# EAGLE design ProbeCDH_r1.0 (EAGLE 5.00)

## Sheet 1 of 2
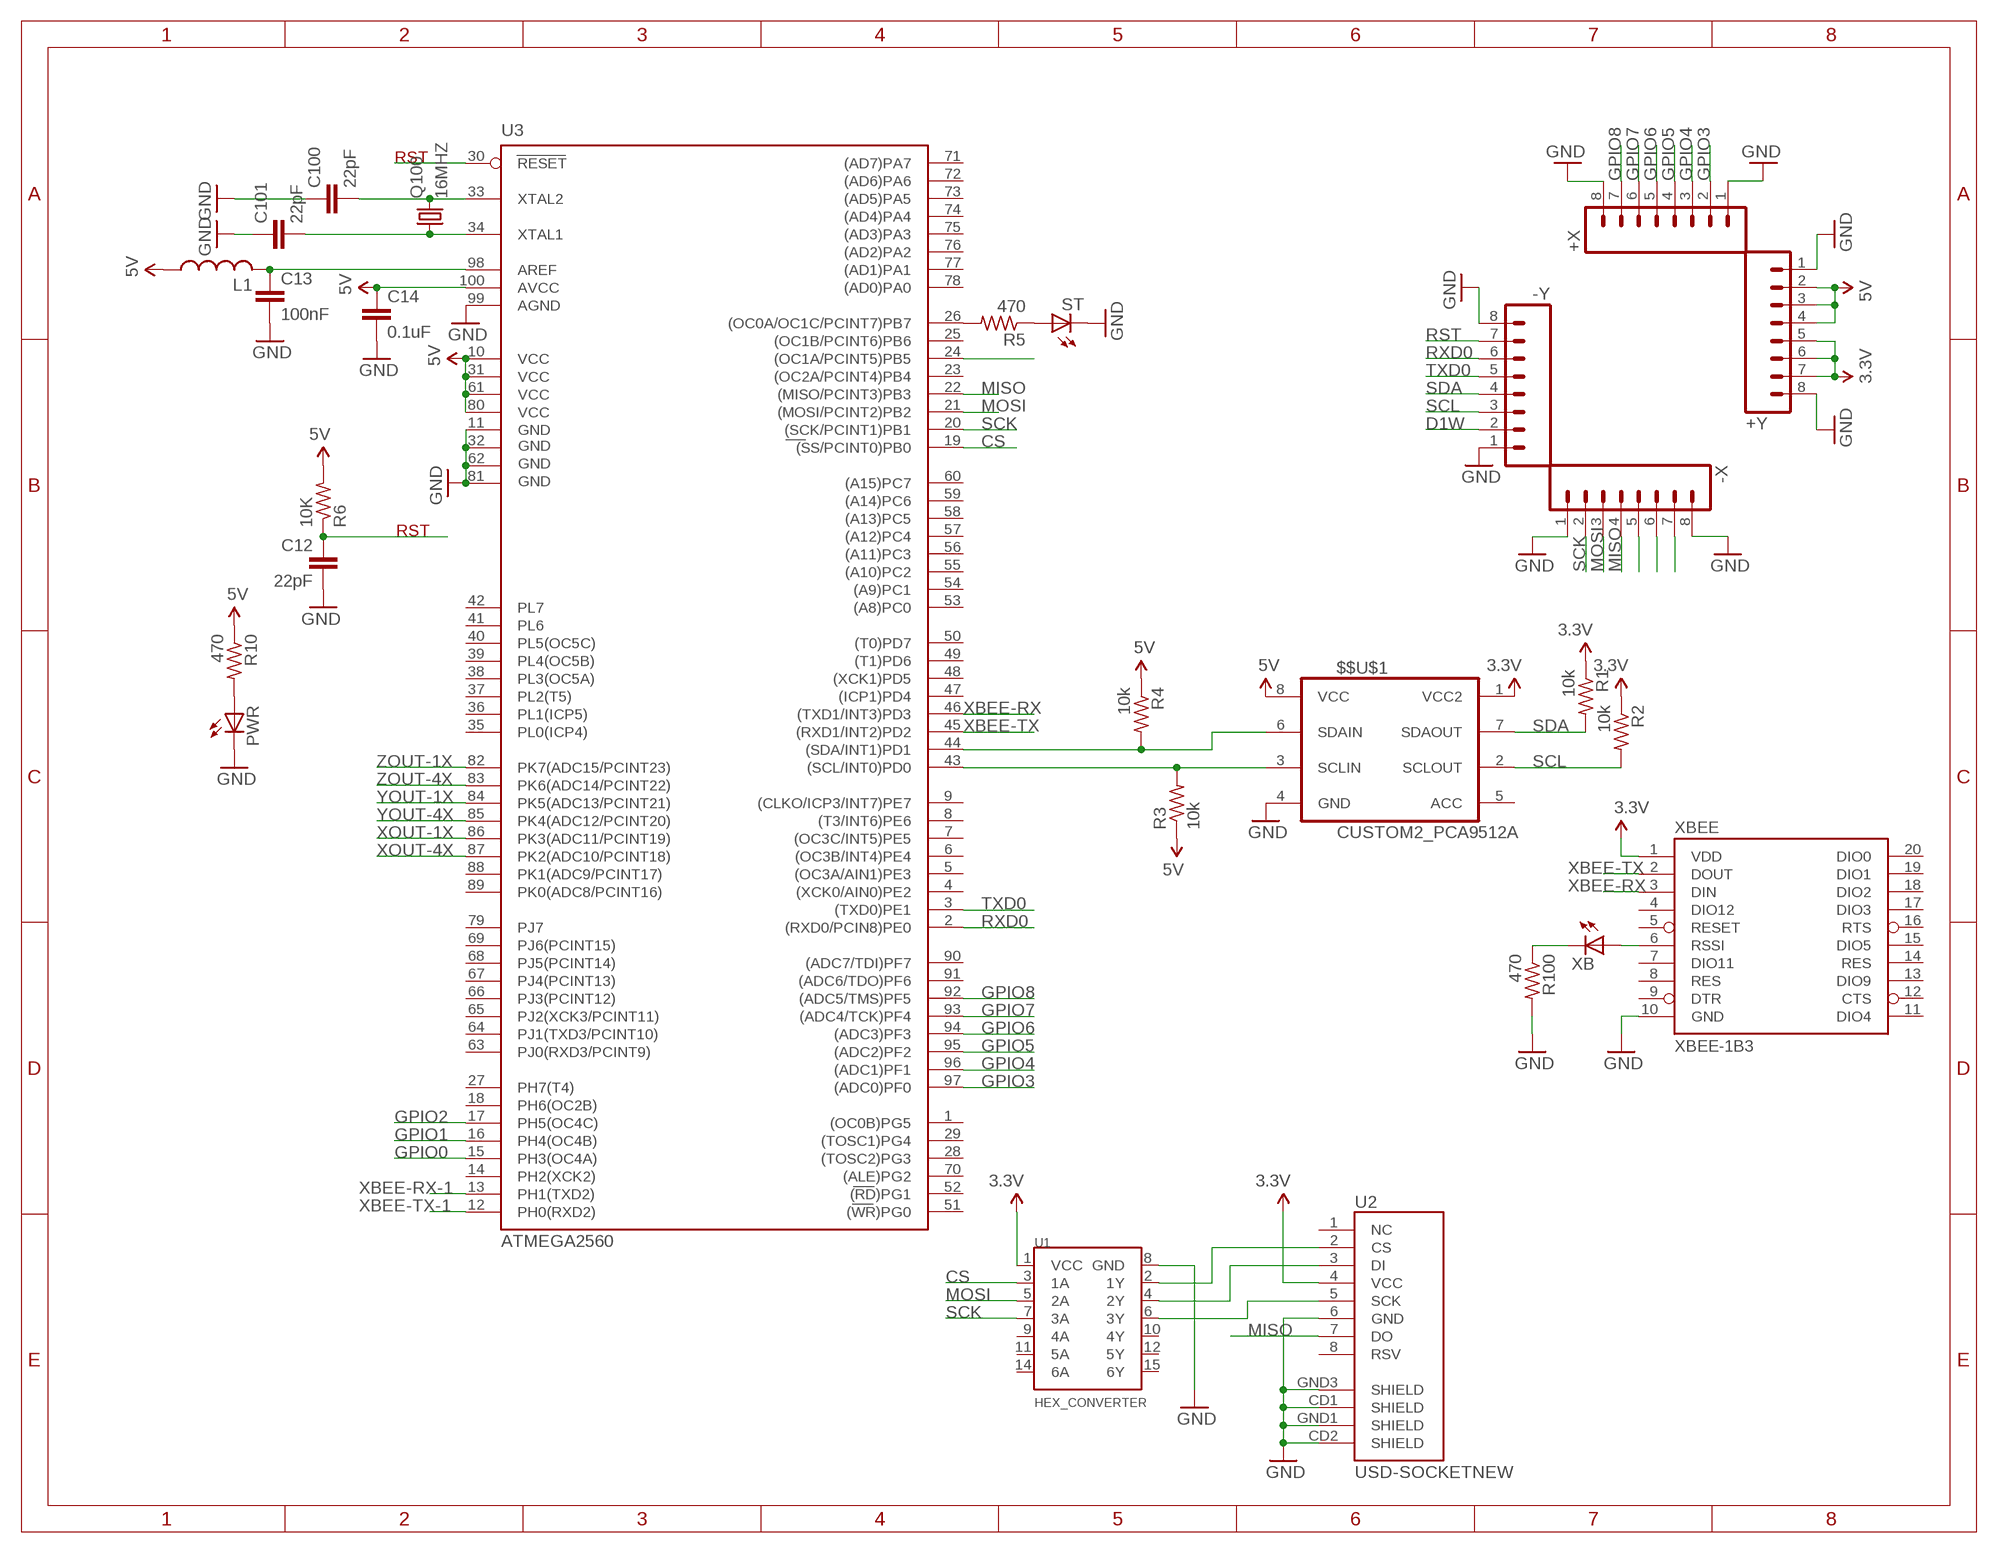
[diagram p0: schematic, sheet 1]

### Parts
$$U$1  CUSTOM2_PCA9512A  [CUSTOM2_SO08]
+X  M08  [1X08]
+Y  M08  [1X08]
-X  M08  [1X08]
-Y  M08  [1X08]
C12  22pF  C-EUC0805K  [C0805K]
C13  100nF  C-EUC0805K  [C0805K]
C14  0.1uF  C-EUC0805K  [C0805K]
C100  22pF  C-EUC0805K  [C0805K]
C101  22pF  C-EUC0805K  [C0805K]
L1  L-USL2012C  [L2012C]
PWR  LED1206  [LED-1206]
Q100  16MHZ  CRYSTAL5X3  [CRYSTAL-SMD-5X3]
R1  10k  R-US_M0805  [M0805]
R2  10k  R-US_M0805  [M0805]
R3  10k  R-US_M0805  [M0805]
R4  10k  R-US_M0805  [M0805]
R5  470  R-US_M0805  [M0805]
R6  10K  R-US_M0805  [M0805]
R10  470  R-US_M0805  [M0805]
R100  470  R-US_M0805  [M0805]
ST  LED1206  [LED-1206]
U1  HEX_CONVERTER  [SO016]
U2  USD-SOCKETNEW  [MICRO-SD-SOCKET-PP]
U3  ATMEGA2560  ATMEGA2560-16AU  [TQFP100]
XB  LED1206  [LED-1206]
XBEE  XBEE-1B3  [XBEE-SMD]

### Nets
3.3V: $$U$1.1(VCC2) +Y.5 +Y.6 +Y.7 R1.1 R2.1 U1.1(VCC) U2.4(VCC) XBEE.1(VDD) ; also sheet 2
5V: $$U$1.8(VCC) +Y.2 +Y.3 +Y.4 C14.1 L1.1 R3.1 R4.1 R6.2 R10.1 U3.10(VCC) U3.31(VCC1) U3.61(VCC2) U3.80(VCC3) U3.100(AVCC)
CS: U1.3(1A) U3.19((SS/PCINT0)PB0)
D1W: -Y.2 U3.24((OC1A/PCINT5)PB5)
GND: $$U$1.4(GND) +X.1 +X.8 +Y.1 +Y.8 -X.1 -X.8 -Y.1 -Y.8 C12.2 C13.2 C14.2 C100.1 C101.1 PWR.C R100.2 ST.C U1.8(GND) U2.6(GND) U2.CD1(SHIELD) U2.CD2(SHIELD) U2.GND1(SHIELD) U2.GND3(SHIELD) U3.11(GND) U3.32(GND1) U3.62(GND2) U3.81(GND3) U3.99(AGND) XBEE.10(GND) ; also sheet 2
GPIO0: -X.7 U3.15(PH3(OC4A))
GPIO1: -X.6 U3.16(PH4(OC4B))
GPIO2: -X.5 U3.17(PH5(OC4C))
GPIO3: +X.2 U3.97((ADC0)PF0)
GPIO4: +X.3 U3.96((ADC1)PF1)
GPIO5: +X.4 U3.95((ADC2)PF2)
GPIO6: +X.5 U3.94((ADC3)PF3)
GPIO7: +X.6 U3.93((ADC4/TCK)PF4)
GPIO8: +X.7 U3.92((ADC5/TMS)PF5)
MISO: -X.4 U2.7(DO) U3.22((MISO/PCINT3)PB3)
MOSI: -X.3 U1.5(2A) U3.21((MOSI/PCINT2)PB2)
N$1: $$U$1.3(SCLIN) R3.2 U3.43((SCL/INT0)PD0)
N$6: XB.A XBEE.6(RSSI)
N$7: C13.1 L1.2 U3.98(AREF)
N$8: R100.1 XB.C
N$9: $$U$1.6(SDAIN) R4.2 U3.44((SDA/INT1)PD1)
N$10: U1.2(1Y) U2.2(CS)
N$11: U1.4(2Y) U2.3(DI)
N$12: U1.6(3Y) U2.5(SCK)
N$13: C100.2 Q100.3 U3.33(XTAL2)
N$14: C101.2 Q100.1 U3.34(XTAL1)
N$29: R5.2 U3.26((OC0A/OC1C/PCINT7)PB7)
N$30: R5.1 ST.A
N$31: PWR.A R10.2
N$37: U3.30(RESET)
RST: -Y.7 C12.1 R6.1
RXD0: -Y.6 U3.2((RXD0/PCIN8)PE0)
SCK: -X.2 U1.7(3A) U3.20((SCK/PCINT1)PB1)
SCL: $$U$1.2(SCLOUT) -Y.3 R2.2 ; also sheet 2
SDA: $$U$1.7(SDAOUT) -Y.4 R1.2 ; also sheet 2
TXD0: -Y.5 U3.3((TXD0)PE1)
XBEE-RX: U3.46((TXD1/INT3)PD3) XBEE.3(DIN)
XBEE-RX-1: U3.13(PH1(TXD2))
XBEE-TX: U3.45((RXD1/INT2)PD2) XBEE.2(DOUT)
XBEE-TX-1: U3.12(PH0(RXD2))
XOUT-1X: U3.86(PK3(ADC11/PCINT19)) ; also sheet 2
XOUT-4X: U3.87(PK2(ADC10/PCINT18)) ; also sheet 2
YOUT-1X: U3.84(PK5(ADC13/PCINT21)) ; also sheet 2
YOUT-4X: U3.85(PK4(ADC12/PCINT20)) ; also sheet 2
ZOUT-1X: U3.82(PK7(ADC15/PCINT23)) ; also sheet 2
ZOUT-4X: U3.83(PK6(ADC14/PCINT22)) ; also sheet 2
Unconnected: $$U$1.5(ACC) U1.9(4A) U1.10(4Y) U1.11(5A) U1.12(5Y) U1.14(6A) U1.15(6Y) U2.1(NC) U2.8(RSV) U3.1((OC0B)PG5) U3.4((XCK0/AIN0)PE2) U3.5((OC3A/AIN1)PE3) U3.6((OC3B/INT4)PE4) U3.7((OC3C/INT5)PE5) U3.8((T3/INT6)PE6) U3.9((CLKO/ICP3/INT7)PE7) U3.14(PH2(XCK2)) U3.18(PH6(OC2B)) U3.23((OC2A/PCINT4)PB4) U3.25((OC1B/PCINT6)PB6) U3.27(PH7(T4)) U3.28((TOSC2)PG3) U3.29((TOSC1)PG4) U3.35(PL0(ICP4)) U3.36(PL1(ICP5)) U3.37(PL2(T5)) U3.38(PL3(OC5A)) U3.39(PL4(OC5B)) U3.40(PL5(OC5C)) U3.41(PL6) U3.42(PL7) U3.47((ICP1)PD4) U3.48((XCK1)PD5) U3.49((T1)PD6) U3.50((T0)PD7) U3.51((WR)PG0) U3.52((RD)PG1) U3.53((A8)PC0) U3.54((A9)PC1) U3.55((A10)PC2) U3.56((A11)PC3) U3.57((A12)PC4) U3.58((A13)PC5) U3.59((A14)PC6) U3.60((A15)PC7) U3.63(PJ0(RXD3/PCINT9)) U3.64(PJ1(TXD3/PCINT10)) U3.65(PJ2(XCK3/PCINT11)) U3.66(PJ3(PCINT12)) U3.67(PJ4(PCINT13)) U3.68(PJ5(PCINT14)) U3.69(PJ6(PCINT15)) U3.70((ALE)PG2) U3.71((AD7)PA7) U3.72((AD6)PA6) U3.73((AD5)PA5) U3.74((AD4)PA4) U3.75((AD3)PA3) U3.76((AD2)PA2) U3.77((AD1)PA1) U3.78((AD0)PA0) U3.79(PJ7) U3.88(PK1(ADC9/PCINT17)) U3.89(PK0(ADC8/PCINT16)) U3.90((ADC7/TDI)PF7) U3.91((ADC6/TDO)PF6) XBEE.4(DIO12) XBEE.5(RESET) XBEE.7(DIO11) XBEE.8(RES) XBEE.9(DTR) XBEE.11(DIO4) XBEE.12(CTS) XBEE.13(DIO9) XBEE.14(RES) XBEE.15(DIO5) XBEE.16(RTS) XBEE.17(DIO3) XBEE.18(DIO2) XBEE.19(DIO1) XBEE.20(DIO0)

### Notes on the sheet
- RST
- RST

## Sheet 2 of 2
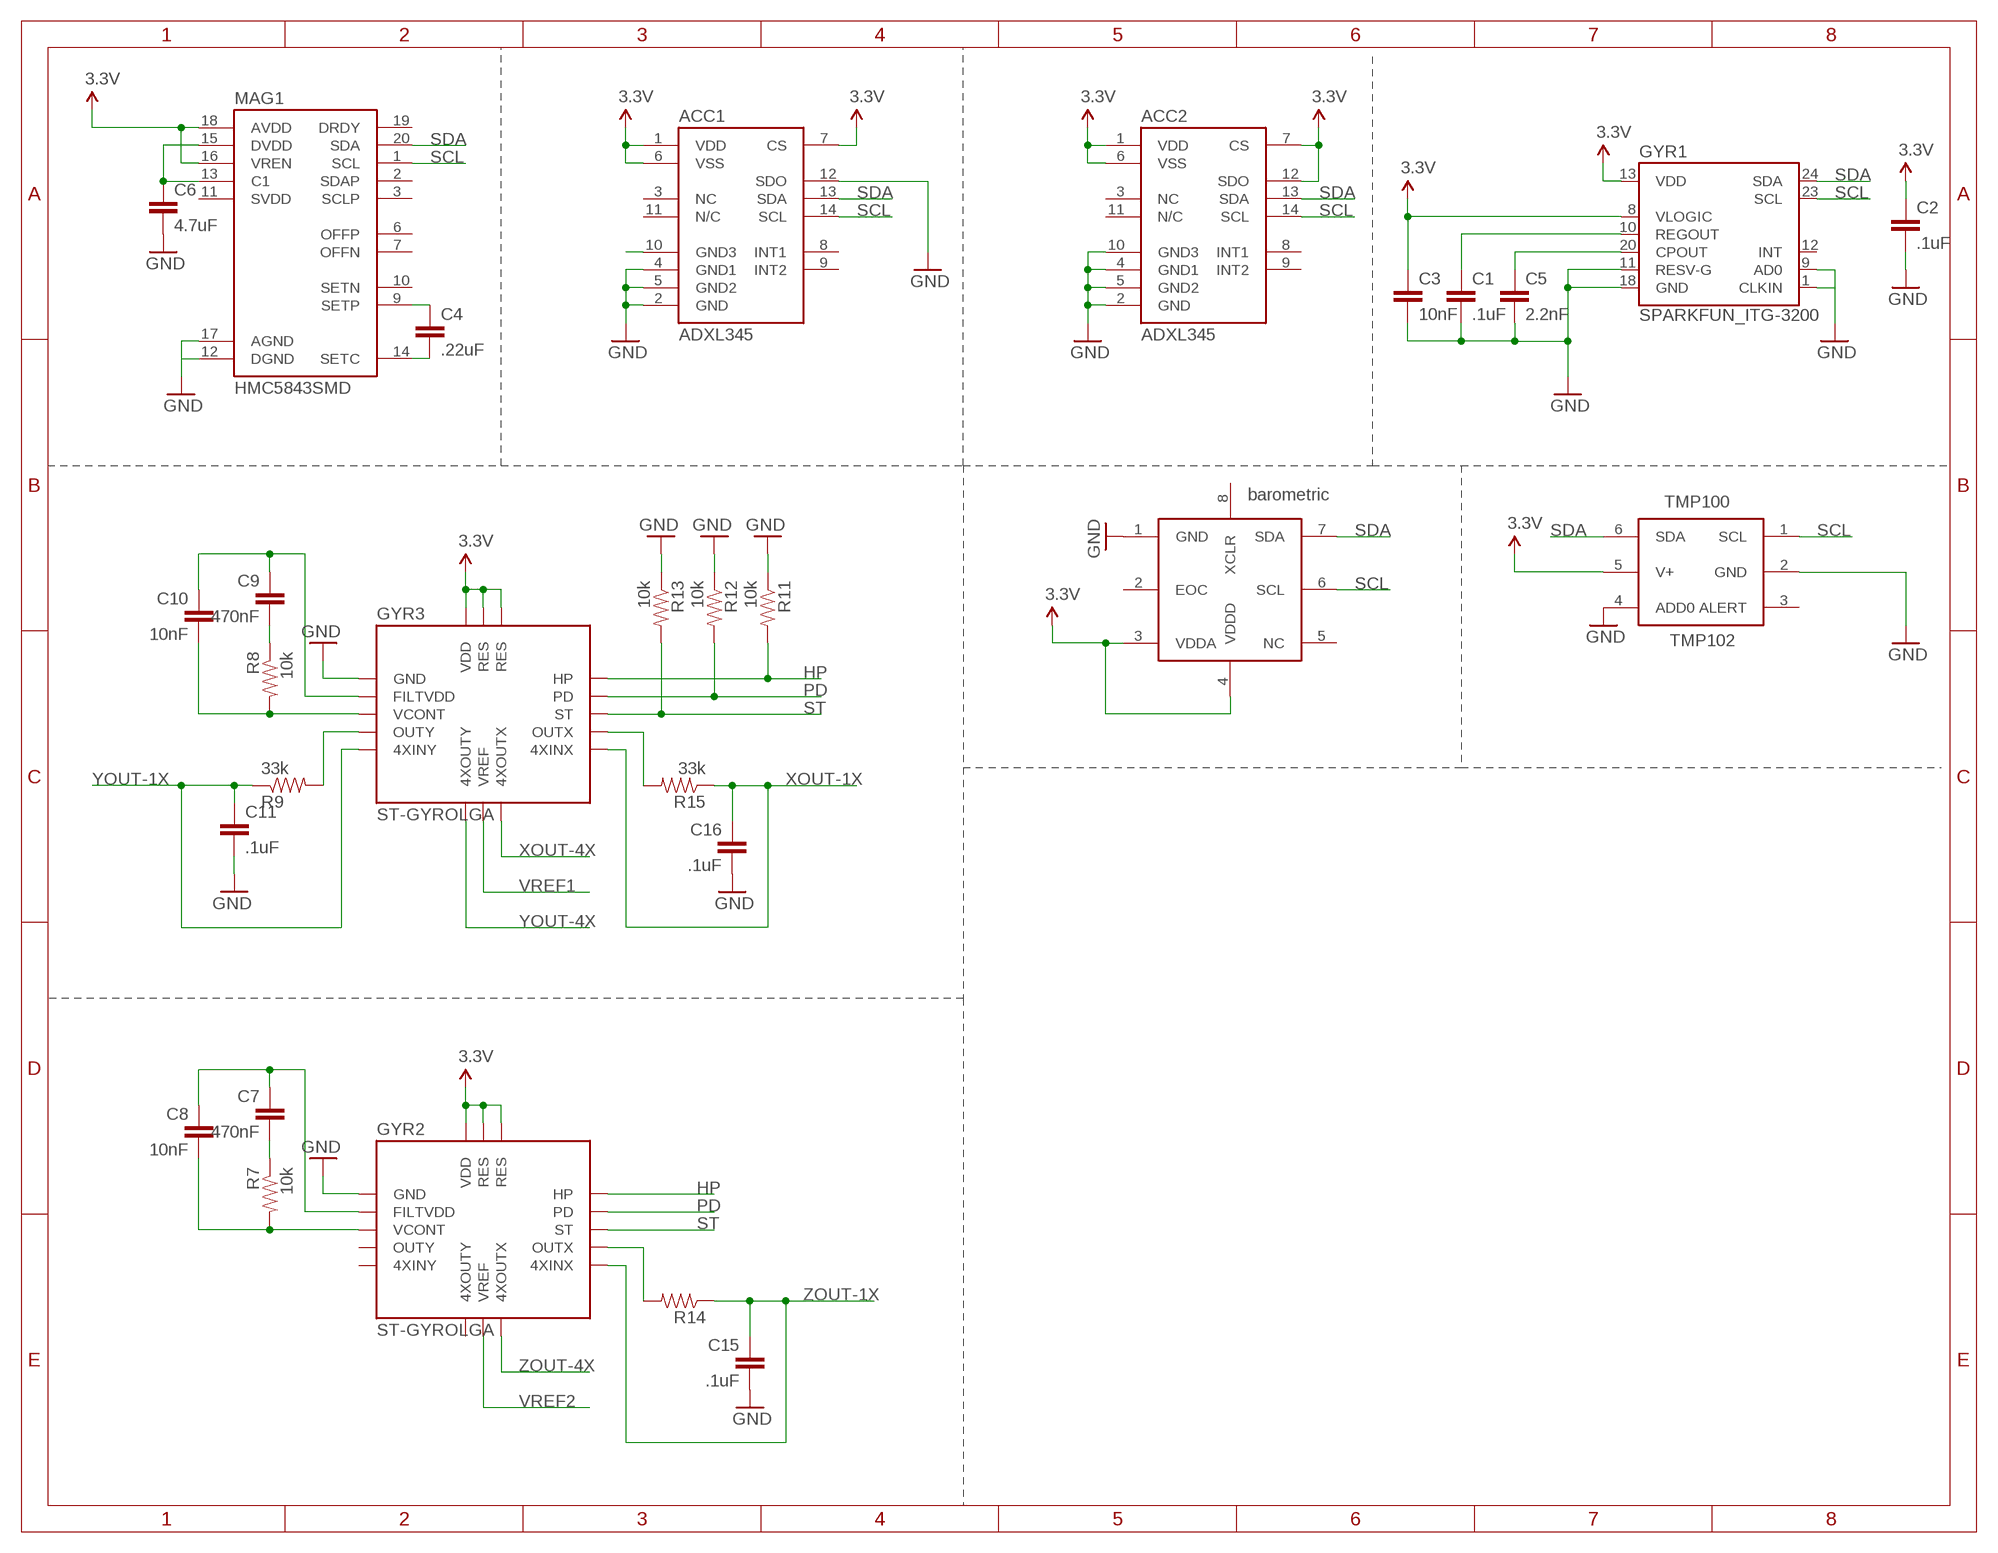
[diagram p1: schematic, sheet 2]

### Parts
ACC1  ADXL345  [LGA14]
ACC2  ADXL345  [LGA14]
BAR100  BMP085  [BMP085]
C1  .1uF  C-EUC0805  [C0805]
C2  .1uF  C-EUC0805  [C0805]
C3  10nF  C-EUC0805  [C0805]
C4  .22uF  C-EUC0805  [C0805]
C5  2.2nF  C-EUC0805  [C0805]
C6  4.7uF  C-EUC0805  [C0805]
C7  470nF  C-EUC0805  [C0805]
C8  10nF  C-EUC0805  [C0805]
C9  470nF  C-EUC0805  [C0805]
C10  10nF  C-EUC0805  [C0805]
C11  .1uF  C-EUC0805  [C0805]
C15  .1uF  C-EUC0805  [C0805]
C16  .1uF  C-EUC0805  [C0805]
GYR1  SPARKFUN_ITG-3200  [SPARKFUN_QFN-24]
GYR2  ST-GYROLGA  [ST-GYRO]
GYR3  ST-GYROLGA  [ST-GYRO]
MAG1  HMC5843SMD  [LPCC20]
R7  10k  RESISTOR  [0805]
R8  10k  RESISTOR  [0805]
R9  33k  RESISTOR  [0805]
R11  10k  RESISTOR  [0805]
R12  10k  RESISTOR  [0805]
R13  10k  RESISTOR  [0805]
R14  RESISTOR  [0805]
R15  33k  RESISTOR  [0805]
TMP100  TMP102  [SOT563]

### Nets
3.3V: ACC1.1(VDD) ACC1.6(VSS) ACC1.7(CS) ACC2.1(VDD) ACC2.6(VSS) ACC2.7(CS) ACC2.12(SDO) BAR100.3(VDDA) BAR100.4(VDDD) C2.1 C3.1 GYR1.8(VLOGIC) GYR1.13(VDD) GYR2.14(RES) GYR2.15(RES) GYR2.16(VDD) GYR3.14(RES) GYR3.15(RES) GYR3.16(VDD) MAG1.16(VREN) MAG1.18(AVDD) TMP100.5(V+) ; also sheet 1
GND: ACC1.2(GND) ACC1.4(GND1) ACC1.5(GND2) ACC1.12(SDO) ACC2.2(GND) ACC2.4(GND1) ACC2.5(GND2) ACC2.10(GND3) BAR100.1(GND) C1.2 C2.2 C3.2 C5.2 C6.2 C11.2 C15.2 C16.2 GYR1.1(CLKIN) GYR1.9(AD0) GYR1.11(RESV-G) GYR1.18(GND) GYR2.1(GND) GYR3.1(GND) MAG1.12(DGND) MAG1.17(AGND) R11.1 R12.1 R13.1 TMP100.2(GND) TMP100.4(ADD0) ; also sheet 1
HP: GYR2.13(HP) GYR3.13(HP) R11.2
N$2: C4.1 MAG1.9(SETP)
N$3: C4.2 MAG1.14(SETC)
N$4: C9.1 C10.1 GYR3.2(FILTVDD)
N$5: C6.1 MAG1.13(C1) MAG1.15(DVDD)
N$20: ACC1.10(GND3)
N$21: C5.1 GYR1.20(CPOUT)
N$22: C1.1 GYR1.10(REGOUT)
N$23: C9.2 R8.1
N$24: C10.2 GYR3.3(VCONT) R8.2
N$25: GYR3.10(OUTX) R15.2
N$28: GYR3.4(OUTY) R9.2
N$42: GYR2.10(OUTX) R14.2
N$45: C7.1 C8.1 GYR2.2(FILTVDD)
N$46: C7.2 R7.1
N$47: C8.2 GYR2.3(VCONT) R7.2
PD: GYR2.12(PD) GYR3.12(PD) R12.2
SCL: ACC1.14(SCL) ACC2.14(SCL) BAR100.6(SCL) GYR1.23(SCL) MAG1.1(SCL) TMP100.1(SCL) ; also sheet 1
SDA: ACC1.13(SDA) ACC2.13(SDA) BAR100.7(SDA) GYR1.24(SDA) MAG1.20(SDA) TMP100.6(SDA) ; also sheet 1
ST: GYR2.11(ST) GYR3.11(ST) R13.2
VREF1: GYR3.7(VREF)
VREF2: GYR2.7(VREF)
XOUT-1X: C16.1 GYR3.9(4XINX) R15.1 ; also sheet 1
XOUT-4X: GYR3.8(4XOUTX) ; also sheet 1
YOUT-1X: C11.1 GYR3.5(4XINY) R9.1 ; also sheet 1
YOUT-4X: GYR3.6(4XOUTY) ; also sheet 1
ZOUT-1X: C15.1 GYR2.9(4XINX) R14.1 ; also sheet 1
ZOUT-4X: GYR2.8(4XOUTX) ; also sheet 1
Unconnected: ACC1.3(NC) ACC1.8(INT1) ACC1.9(INT2) ACC1.11(N/C) ACC2.3(NC) ACC2.8(INT1) ACC2.9(INT2) ACC2.11(N/C) BAR100.2(EOC) BAR100.5(NC) BAR100.8(XCLR) GYR1.12(INT) GYR2.4(OUTY) GYR2.5(4XINY) GYR2.6(4XOUTY) MAG1.2(SDAP) MAG1.3(SCLP) MAG1.6(OFFP) MAG1.7(OFFN) MAG1.10(SETN) MAG1.11(SVDD) MAG1.19(DRDY) TMP100.3(ALERT)

### Notes on the sheet
- barometric

## Library data of the parts
$$U$1 = interface-rev1_2:CUSTOM2_PCA9512A: Level Shifting I2C Voltage Translator
+X +Y -X -Y = SparkFun:M08: Header 8 Standard 8-pin 0.1" header. Use with straight break away headers (SKU : PRT-00116), right angle break away headers (PRT-00553), swiss pins (PRT-00743), machine pins (PRT-00117), and female headers (PRT-00115).
ACC1 ACC2 = SparkFun:ADXL345
BAR100 = SparkFun:BMP085
C1-C16 C100 C101 = rcl:C-EU: CAPACITOR, European symbol
GYR1 = 9DoF-Stick-v12:SPARKFUN_ITG-3200: ITG-3200 3-axis gyro, digital output, qfn24 package
GYR2 GYR3 = SparkFun3:ST-GYRO
L1 = rcl:L-US: INDUCTOR, American symbol
MAG1 = SparkFun:HMC5843
PWR ST XB = SparkFun:LED: LEDs Standard schematic elements and footprints for 5mm, 3mm, 1206, and 0603 sized LEDs. 5mm - Spark Fun Electronics SKU : COM-00529 (and others)
Q100 = SparkFun:CRYSTAL: Crystals Various standard crystals. Proven footprints. Spark Fun Electronics SKU : COM-00534
R1-R6 R10 R100 = rcl:R-US_: RESISTOR, American symbol
R7-R9 R11-R15 = SparkFun3:RESISTOR: Resistor Basic schematic elements and footprints for 0603, 1206, and PTH 1/10th watt (small) resistors.
TMP100 = SparkFun:TMP102
U1 = SparkFun:HEX_CONVERTER
U2 = SparkFun:USD-SOCKET: microSD Socket Push-push type uSD socket. Schematic element and footprint production proven. Spark Fun Electronics SKU : PRT-00127. tDoc lines correctly indicate media card edge positions when inserting (unlocked, locked, depressed).
U3 = atmel-2005:ATMEGA*: MICROCONTROLLER 64/128/256 Kbytes FLASH 4 Kbytes EEPROM 8 Kbytes SRAM 86 General Purpose I/O pins 12-channels16-bit PWM 4 x Serial USARTs 16-channels 10-bit A/D
XBEE = SparkFun:XBEE-1

## Board
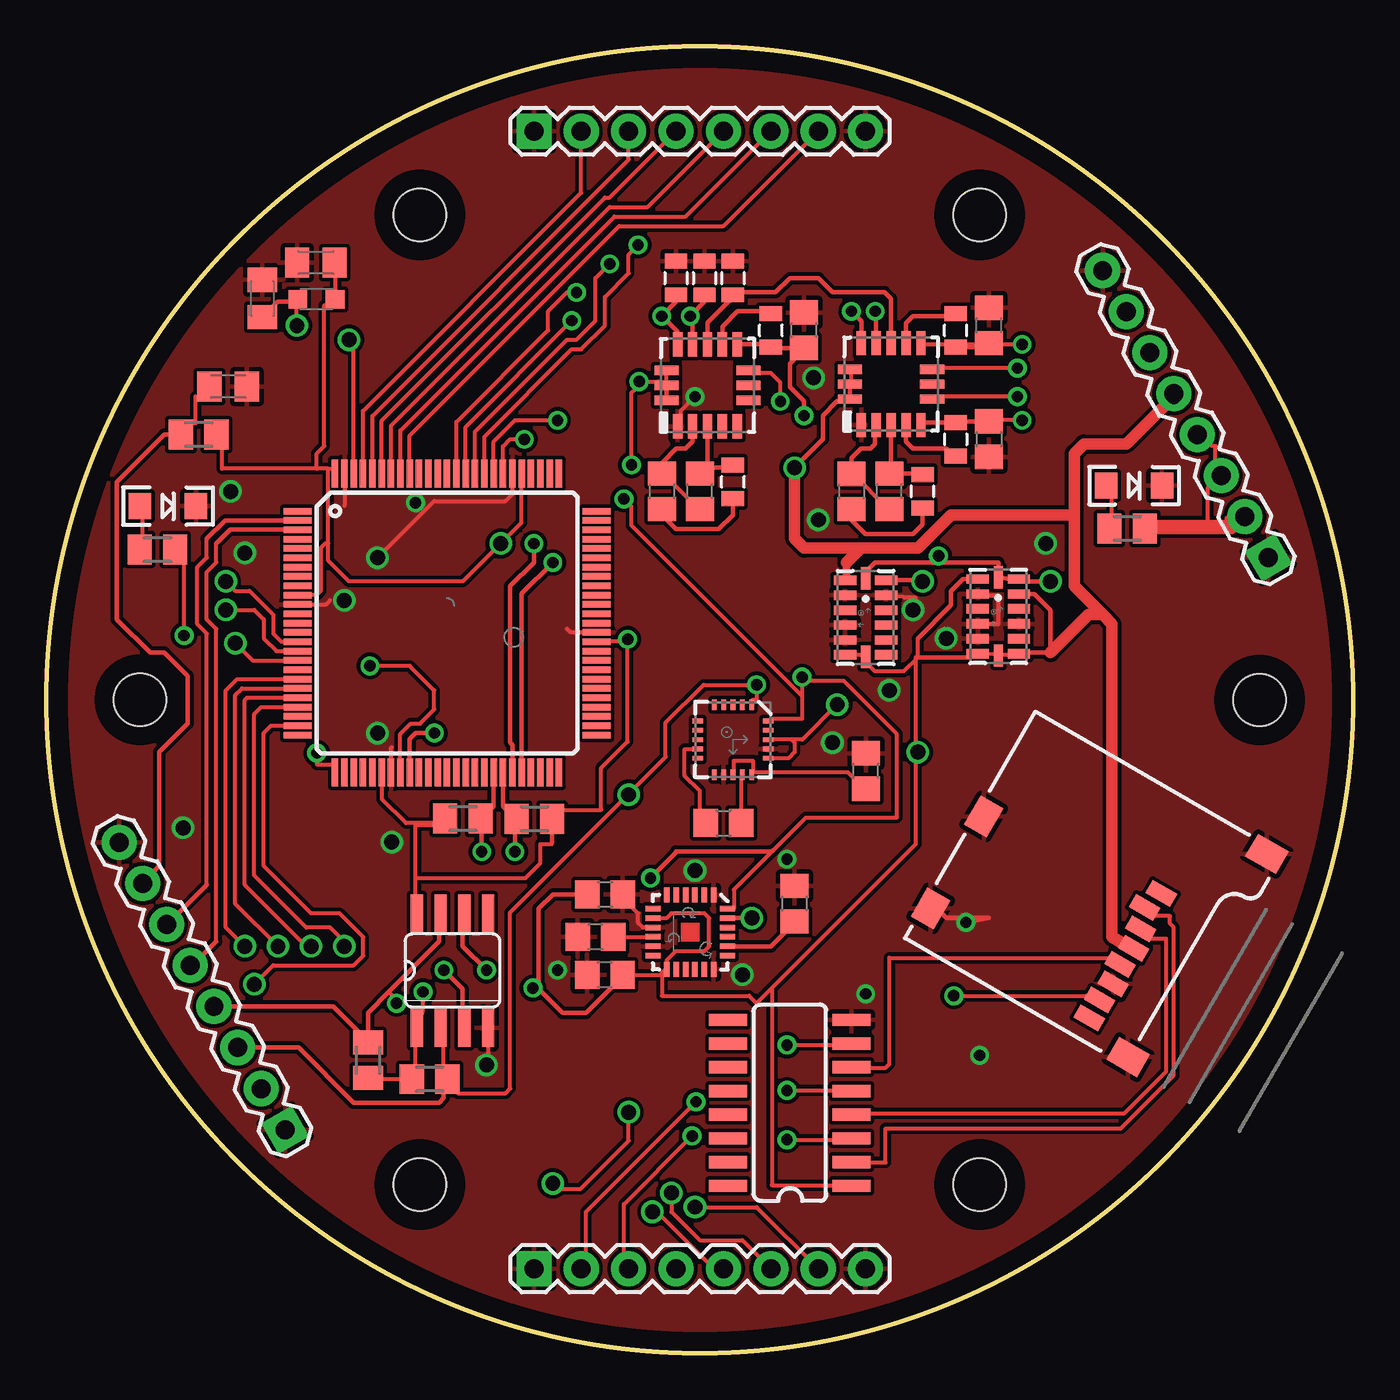
[diagram p2: board, top side]
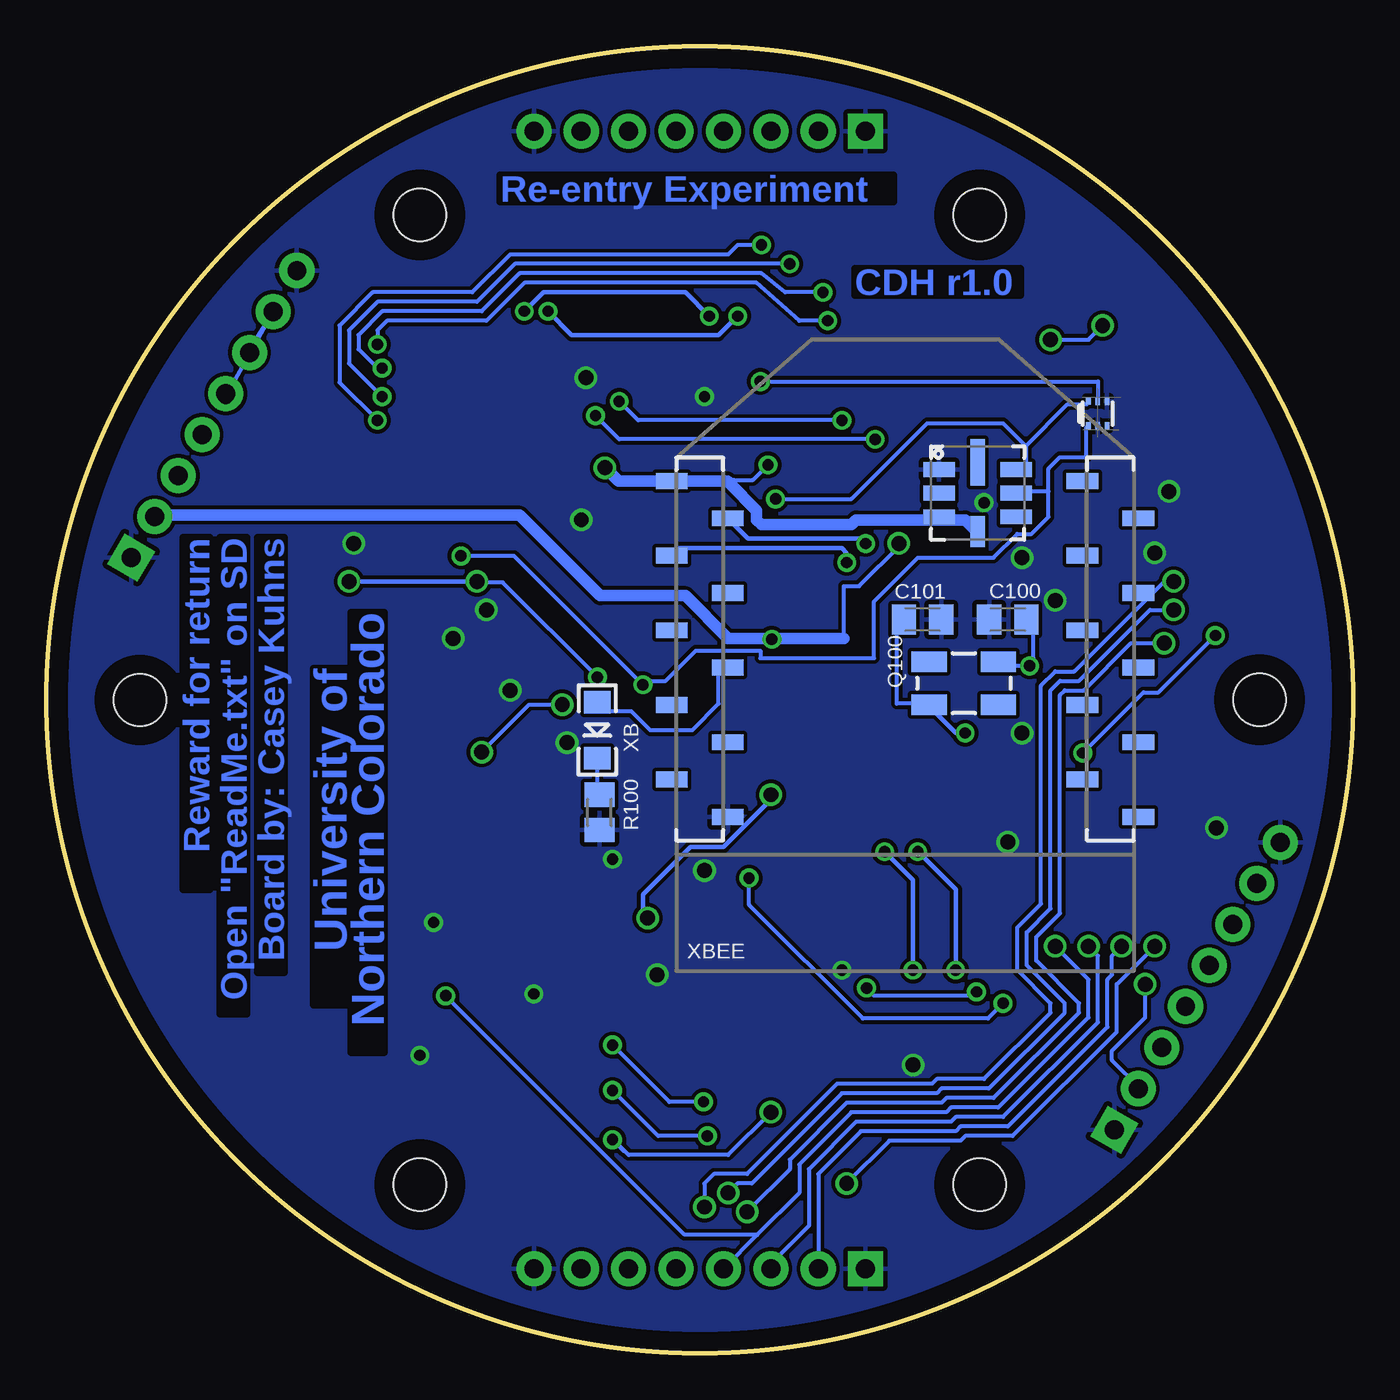
[diagram p3: board, bottom side, seen from below]

Size 70 x 70 mm. Coordinates in mm from the lower left corner, seen from the top.
Outline: circle at 35,35 radius 35
Copper layers (1*16): Top 0.035mm / dielectric 1.5mm / Bottom 0.035mm
Design rules "default *": minimum track width 8mil, minimum drill 24mil, track to track 8mil, track to pad 8mil, pad to pad 8mil, via to via 8mil, smd to smd 8mil, copper to edge 40mil, drill to drill 8mil, minimum pad ring 10mil, minimum via ring 8mil, stop-mask expansion 4mil, vias tented up to drill 0mil, thermal gap 10mil
Holes 2.8 mm at 5,35 65,34.99 50,60.98 50,9.02 20,9.02 20,60.98

### Footprints (pad centres in the part's own frame; a part is rotated, then mirrored left to right if it is on the bottom)
CUSTOM2_SO08 = smd 0.66 x 2.032: 1 -1.905,-3.073; 2 -0.635,-3.073; 3 0.635,-3.073; 4 1.905,-3.073; 5 1.905,3.073; 6 0.635,3.073; 7 -0.635,3.073; 8 -1.905,3.073
1X08 = drill 1.016 pad 1.88 square: 1 0,0 | drill 1.016 pad 1.88 round: 2 2.54,0; 3 5.08,0; 4 7.62,0; 5 10.16,0; 6 12.7,0; 7 15.24,0; 8 17.78,0
LGA14 = smd 0.5 x 1.2: 1 2,1.1; 2 1.2,1.1; 3 0.4,1.1; 4 -0.4,1.1; 5 -1.2,1.1; 6 -2,1.1; 8 -2,-1.1; 9 -1.2,-1.1; 10 -0.4,-1.1; 11 0.4,-1.1; 12 1.2,-1.1; 13 2,-1.1 | smd 1.2 x 0.5: 7 -2.1,0; 14 2.1,0
BMP085 = smd 1.67 x 0.8: 1 -2.065,1.27; 2 -2.065,0; 3 -2.065,-1.27; 5 2.065,-1.27; 6 2.065,0; 7 2.065,1.27 | smd 0.8 x 1.67: 4 0,-2.065 | smd 0.8 x 2.5: 8 0,1.65
C0805 = smd 1.3 x 1.5: 1 -0.95,0; 2 0.95,0
C0805K = smd 1.3 x 1.6: 1 -1,0; 2 1,0
SPARKFUN_QFN-24 = smd 0.8 x 0.3: 1 -2,1.25; 2 -2,0.75; 3 -2,0.25; 4 -2,-0.25; 5 -2,-0.75; 6 -2,-1.25; 13 2,-1.25; 14 2,-0.75; 15 2,-0.25; 16 2,0.25; 17 2,0.75; 18 2,1.25 | smd 0.3 x 0.8: 7 -1.25,-2; 8 -0.75,-2; 9 -0.25,-2; 10 0.25,-2; 11 0.75,-2; 12 1.25,-2; 19 1.25,2; 20 0.75,2; 21 0.25,2; 22 -0.25,2; 23 -0.75,2; 24 -1.25,2
ST-GYRO = smd 1.3 x 0.5: 1 -2.2,1.6; 2 -2.2,0.8; 3 -2.2,0; 4 -2.2,-0.8; 5 -2.2,-1.6; 9 2.2,-1.6; 10 2.2,-0.8; 11 2.2,0; 12 2.2,0.8; 13 2.2,1.6 | smd 0.5 x 1.3: 6 -0.8,-2.2; 7 0,-2.2; 8 0.8,-2.2; 14 0.8,2.2; 15 0,2.2; 16 -0.8,2.2
L2012C = smd 1 x 1: 1 -1,0; 2 1,0
LPCC20 = smd 0.25 x 0.56: 1 1,1.88; 2 0.5,1.88; 3 0,1.88; 4 -0.5,1.88; 5 -1,1.88; 11 -1,-1.88; 12 -0.5,-1.88; 13 0,-1.88; 14 0.5,-1.88; 15 1,-1.88 | smd 0.56 x 0.25: 6 -1.88,1; 7 -1.88,0.5; 8 -1.88,0; 9 -1.88,-0.5; 10 -1.88,-1; 16 1.88,-1; 17 1.88,-0.5; 18 1.88,0; 19 1.88,0.5; 20 1.88,1
LED-1206 = smd 1.2 x 1.4: A -1.5,0; C 1.5,0
CRYSTAL-SMD-5X3 = smd 1.9 x 1.1: 1 -1.85,-1.15; 2 1.85,-1.15; 3 1.85,1.15; 4 -1.85,1.15
M0805 = smd 1.3 x 1.6: 1 -0.95,0; 2 0.95,0
0805 = smd 0.8 x 1.2: 1 -0.9,0; 2 0.9,0
SOT563 = smd 0.25 x 0.4: 1 0.3,-0.06; 2 0.8,-0.06; 3 1.3,-0.06; 4 1.3,1.26; 5 0.8,1.26; 6 0.3,1.27
SO016 = smd 0.66 x 2.032: 1 -4.445,-3.315; 2 -3.175,-3.315; 3 -1.905,-3.315; 4 -0.635,-3.315; 5 0.635,-3.315; 6 1.905,-3.315; 7 3.175,-3.315; 8 4.445,-3.315; 9 4.445,3.315; 10 3.175,3.315; 11 1.905,3.315; 12 0.635,3.315; 13 -0.635,3.315; 14 -1.905,3.315; 15 -3.175,3.315; 16 -4.445,3.315
MICRO-SD-SOCKET-PP = smd 0.8 x 1.5: 1 -8.94,10.7; 2 -7.84,10.3; 3 -6.74,10.7; 4 -5.64,10.9; 5 -4.54,10.7; 6 -3.44,10.9; 7 -2.34,10.7; 8 -1.24,10.7 | smd 1.8 x 1.4: CD1 -2.05,0.4; CD2 -7.75,0.4 | smd 1.4 x 1.9: GND1 -13.6,14.55; GND3 -0.45,13.55
TQFP100 = smd 1.5 x 0.35: 1 -8,6; 2 -8,5.5; 3 -8,5; 4 -8,4.5; 5 -8,4; 6 -8,3.5; 7 -8,3; 8 -8,2.5; 9 -8,2; 10 -8,1.5; 11 -8,1; 12 -8,0.5; 13 -8,0; 14 -8,-0.5; 15 -8,-1; 16 -8,-1.5; 17 -8,-2; 18 -8,-2.5; 19 -8,-3; 20 -8,-3.5; 21 -8,-4; 22 -8,-4.5; 23 -8,-5; 24 -8,-5.5; 25 -8,-6; 51 8,-6; 52 8,-5.5; 53 8,-5; 54 8,-4.5; 55 8,-4; 56 8,-3.5; 57 8,-3; 58 8,-2.5; 59 8,-2; 60 8,-1.5; 61 8,-1; 62 8,-0.5; 63 8,0; 64 8,0.5; 65 8,1; 66 8,1.5; 67 8,2; 68 8,2.5; 69 8,3; 70 8,3.5; 71 8,4; 72 8,4.5; 73 8,5; 74 8,5.5; 75 8,6 | smd 0.35 x 1.5: 26 -6,-8; 27 -5.5,-8; 28 -5,-8; 29 -4.5,-8; 30 -4,-8; 31 -3.5,-8; 32 -3,-8; 33 -2.5,-8; 34 -2,-8; 35 -1.5,-8; 36 -1,-8; 37 -0.5,-8; 38 0,-8; 39 0.5,-8; 40 1,-8; 41 1.5,-8; 42 2,-8; 43 2.5,-8; 44 3,-8; 45 3.5,-8; 46 4,-8; 47 4.5,-8; 48 5,-8; 49 5.5,-8; 50 6,-8; 76 6,8; 77 5.5,8; 78 5,8; 79 4.5,8; 80 4,8; 81 3.5,8; 82 3,8; 83 2.5,8; 84 2,8; 85 1.5,8; 86 1,8; 87 0.5,8; 88 0,8; 89 -0.5,8; 90 -1,8; 91 -1.5,8; 92 -2,8; 93 -2.5,8; 94 -3,8; 95 -3.5,8; 96 -4,8; 97 -4.5,8; 98 -5,8; 99 -5.5,8; 100 -6,8
XBEE-SMD = smd 1.7 x 0.85: 1 -12.5,20; 2 -9.5,18; 3 -12.5,16; 4 -9.5,14; 5 -12.5,12; 6 -9.5,10; 7 -12.5,8; 8 -9.5,6; 9 -12.5,4; 10 -9.5,2; 11 12.5,2; 12 9.5,4; 13 12.5,6; 14 9.5,8; 15 12.5,10; 16 9.5,12; 17 12.5,14; 18 9.5,16; 19 12.5,18; 20 9.5,20

### Placement (x,y rotation side)
$$U$1  21.75,20.49 0 top
+X  26.11,65.47 0 top
+Y  65.48,42.61 120 top
-X  26.11,4.51 0 top
-Y  12.78,11.96 120 top
ACC1  43.89,39.4 90 top
ACC2  51,39.47 90 top
BAR100  20.11,46.07 0 bottom
C1  29.41,22.29 180 top
C2  29.92,20.26 180 top
C3  29.92,24.58 0 top
C4  36.27,28.39 0 top
C5  40.08,24.07 90 top
C6  43.89,31.18 90 top
C7  32.97,46.17 270 top
C8  35,46.17 90 top
C9  43.13,46.16 270 top
C10  45.16,46.17 90 top
C11  50.5,48.96 270 top
C12  9.73,51.79 0 top
C13  11.56,56.51 90 top
C14  14.43,58.42 180 top
C15  40.59,54.8 90 top
C16  50.49,55.06 90 top
C100  18.49,39.31 0 bottom
C101  23.06,39.31 180 bottom
GYR1  34.49,22.54 270 top
GYR2  35.41,51.85 90 top
GYR3  45.25,51.91 90 top
L1  14.46,56.45 180 top
MAG1  36.78,32.86 0 top
PWR  58.27,46.47 0 top
Q100  20.85,35.88 0 bottom
R1  17.22,15.69 90 top
R2  20.52,14.67 0 top
R3  22.31,28.63 0 top
R4  26.14,28.62 180 top
R5  5.94,43.04 0 top
R6  8.14,49.21 0 top
R7  36.78,46.67 90 top
R8  46.94,46.17 90 top
R9  48.72,48.96 270 top
R10  57.91,44.18 180 top
R11  33.73,57.6 270 top
R12  35.25,57.6 270 top
R13  36.78,57.6 270 top
R14  38.81,54.8 90 top
R15  48.72,54.8 90 top
R100  40.38,28.97 270 bottom
ST  6.5,45.38 0 top
TMP100  14.47,49.74 0 bottom
U1  39.83,13.4 90 top
U2  45.99,22.24 240 top
U3  21.46,39.11 0 top
XB  40.49,33.37 270 bottom
XBEE  24,26.72 0 bottom

### Tracks (layer width: path | path; a pad name or v marks a point on that pad's centre or on a via)
3.3V  (via drill 0.61, 0.8)
  Top 0.203: 33.21,52.76 GYR2.14 | 33.21,52 33.21,52.76 | 33.21,52.76 33.22,52.77 | GYR3.14 43.11,52.77 43.13,52.77 43.13,51.99 GYR3.15 | GYR1.8 33.21,23.29 33.48,23.56 35.25,23.56 35.51,23.31 35.51,21.78 35.25,21.53 33.73,21.53 33.22,21.02 33.24,21 GYR1.13 | ACC2.7 52.07,37.43 52.02,37.43 51.66,37.43 ACC2.6 | R1.1 17.98,14.67 R2.1 19.76,15.43 19.76,16.45 $$U$1.1 20.17,18.33 v20.17,19.34 | C2.1 31.44,20.26 33.22,20.26 GYR1.13 | v26.06,19.55 26.26,19.55 26.36,19.5 | GYR1.13 33.17,20.56 32.97,20.36 32.97,19.14 37.64,19.14 38.05,18.73 38.86,19.55 | GYR2.15 32.77,52.06 v31.75,52.06 31.55,51.65 31.34,51.45 v31.34,47.59 | 38.86,19.55 46.58,27.27 46.58,32.7 | 46.58,32.7 46.58,37.28 | MAG1.16 39.75,31.86 40.08,32.2 40.08,32.7 39.92,32.86 | 39.92,32.86 MAG1.18 | 39.92,32.86 40.49,32.86 v42.37,34.74 | 46.58,32.7 46.68,32.7 v46.68,32.2 | 38.86,19.55 38.86,8.98 42.32,8.98 U1.1 | ACC1.6 43.76,37.4 43.89,37.28 ACC1.7 43.89,37.02 44.4,36.51 45.92,36.51 46.68,37.28 46.68,38.29
  Top 0.254: GYR3.15 43.05,51.32 43.13,51.25 43.05,51.17 GYR3.16 42.93,50.99 42.37,50.99 41.6,50.23 41.6,48.96 v40.08,47.44 | GYR2.16 GYR2.15 33.21,52 33.22,52.01 | C3.1 27.13,24.58 26.36,23.81 26.36,19.5 27.63,18.23 28.9,18.23 30.93,20.26 | 30.93,20.26 30.94,20.26 | 30.93,20.26 C2.1 | ACC2.1 49.1,41.47 48.46,40.83 48.46,40.07 46.68,38.29 | ACC2.6 49.79,37.47 49.73,37.53 49.48,37.28 46.68,37.28 46.58,37.28 | ACC2.12 52.94,40.67 53.8,39.82 53.8,37.53 52.02,37.53 52.02,37.43 | 57.1,33.97 57.1,22.29 57.61,21.78 58.14,21.78 U2.4 | ACC1.6 42.66,37.28
  Top 0.406: ACC1.1 42.87,41.49 42.87,42.36
  Top 0.61: v60.4,51.25 57.86,48.71 55.57,48.71 55.07,48.2 55.07,44.9 | 55.07,44.9 55.07,41.09 56.59,39.56 | 56.59,39.56 57.1,39.05 57.1,22.29 58.37,21.53 | 53.8,37.53 55.83,39.56 56.59,39.56 | 43.64,43.12 42.87,42.36 | 43.64,43.12 46.68,43.12 48.46,44.9 55.07,44.9 | 43.64,43.12 40.59,43.12 40.08,43.63 v40.08,47.44
  Bottom 0.203: BAR100.4 20.37,44.54 21.39,44.54 BAR100.3 | v20.17,19.34 20.37,19.14 25.65,19.14 v26.06,19.55 | v31.75,52.06 13.66,52.06 13.66,51.04 TMP100.5 | v31.34,47.59 32.16,46.78 33.17,46.78 33.37,46.57 | v42.37,34.74 44.14,34.74 v46.68,32.2
  Bottom 0.254: +Y.5 v60.4,51.25 +Y.7 59.13,53.79 +Y.6
  Bottom 0.61: v40.08,47.44 39.36,46.72 XBEE.1 33.52,46.72 33.37,46.57 31.95,45.15 31.95,44.64 31.7,44.39 26.87,44.39 26.62,44.64 20.78,44.64 20.11,43.97 | 20.11,43.97 20.01,43.88 | 20.11,43.97 BAR100.4
5V  (via drill 0.61, 0.8)
  Top 0.203: C14.1 15.49,57.75 15.49,56.94 L1.1 15.09,56.12 14.88,56.12 14.88,48.6 14.48,48.2 14.48,47.38 | 62.23,44.54 63.25,44.54 63.25,44.74 +Y.2 | 62.23,44.54 59.38,44.54 R10.1 | 62.23,44.54 62.23,46.37 +Y.3 62.64,47.79 62.64,48.6 62.43,48.6 +Y.4 | 19.76,25.44 19.76,24.42 $$U$1.8 | 19.76,25.44 19.76,28.28 20.78,28.28 R3.1 21.28,28.56 21.28,28.39 19.25,28.39 17.98,29.66 17.98,31.08 U3.31 | 19.76,25.44 25.65,25.44 26.47,26.25 26.47,27.27 27.08,27.27 27.09,27.33 | v31.14,38.24 31.14,32.75 29.72,31.33 29.72,29.1 27.69,29.1 R4.1 | 14.48,47.38 9.4,47.38 9.4,48.6 R6.2 | 15.09,47.38 14.48,47.38 | 15.09,47.38 15.29,47.38 U3.100 | 15.09,43.37 15.09,47.38 | U3.80 25.45,46.37 25.45,44.49 v24.33,43.37 24.28,43.32 | v31.14,38.24 31.19,38.29 | U3.61 31.01,38.11 v31.14,38.24 | U3.10 14.46,40.61 14.68,40.83 14.68,43.12 14.93,43.37 15.09,43.37 | 15.09,43.37 15.09,42.46 16.2,41.34 22.3,41.34 24.28,43.32 | 24.28,43.32 24.23,43.32
  Top 0.254: 27.09,27.33 R4.1
  Top 0.61: R10.1 63.5,44.18 v64.21,44.9
  Bottom 0.203: v31.14,38.24 31.14,38.29 | 27.28,38.29 27.28,41.09 26.47,41.09 24.23,43.32 24.23,43.22 24.33,43.12 v24.33,43.37
  Bottom 0.61: v64.21,44.9 44.65,44.9 40.33,40.58 35.76,40.58 33.48,38.29 31.14,38.29 27.28,38.29
CS  (via drill 0.61, 0.8)
  Top 0.203: U3.19 10.21,36.11 9.6,35.5 9.6,22.8 v10.62,21.78 | v39.67,11.42 42.32,11.42 U1.3 | v27.13,9.08 27.48,8.78 28.6,8.78 31.19,11.37 v31.19,12.89
  Bottom 0.203: v27.13,9.08 24.84,11.37 21.03,11.37 20.78,11.62 18.24,11.62 12.65,17.21 12.65,19.75 v10.62,21.78 | 39.06,10.81 v39.67,11.42 39.62,11.42 38.81,10.61 33.48,10.61 v31.19,12.89
D1W  (via drill 0.8)
  Top 0.203: U3.24 12.03,33.61 11.63,33.21 11.63,26.1 14.17,23.56 15.7,23.56 16.97,22.29 16.97,21.27 16.46,20.77 12.14,20.77 v11.12,19.75
  Bottom 0.203: v11.12,19.75 11.12,17.97 12.9,16.19 12.9,15.69 11.38,14.16 -Y.2
GND  (via drill 0.6, 0.61, 0.8)
  Top 0.203: C1.2 28.6,22.75 | GYR1.9 31.96,22.79 31.7,23.05 31.7,23.56 30.94,24.32 C3.2 | 45.97,40.48 46.58,40.48 ACC1.12 | v34.75,51.25 33.98,50.48 33.98,50.23 GYR2.1 | U3.62 28.08,38.61 27.89,38.8 | U3.32 18.46,32.42 18.49,32.45 | 24.96,46.03 24.84,45.91 | 24.96,46.03 U3.81 | 24.96,46.03 24.59,45.66 20.78,45.66 v17.73,42.61 | U3.99 15.96,45.41 15.95,45.4 | U3.11 14.97,40.11 15.19,40.32 | $$U$1.4 23.65,15.51 v23.57,15.43
  Top 0.254: U2.CD1 47.7,23.81 48.21,23.31 50.49,23.31 v49.26,23.07 | ACC2.2 49.99,40.58 51,40.58 51,39.05 49.92,39.05 ACC2.4
  other vias: 27.38,20.51 43.89,19.24 50,15.94 48.21,38.29 46.43,39.82 41.35,44.64 41.1,52.26 34.75,25.85 37.29,20.26 45.16,35.5 42.11,32.7 17.73,33.21 9.85,46.17 39.67,26.46 19.76,45.56 15.95,40.32 18.49,27.37 10.62,42.86 7.31,28.13 53.54,43.37
  pour Top: -0.31,70.3 -0.31,-0.32 70.31,-0.32 70.31,70.3
  pour Bottom: -0.31,70.3 -0.31,-0.32 70.31,-0.32 70.31,70.3
GPIO0  (via drill 0.8)
  Top 0.203: U3.15 12.58,38.11 12.14,38.55 12.14,39.56 10.87,40.83 10.11,40.83 v9.6,41.34 | v34.75,7.81 38.05,7.81 -X.7
  Bottom 0.203: v9.6,41.34 10.11,41.34 14.93,36.51 15.95,36.51 16.71,35.75 16.71,24.07 17.98,22.8 17.98,20.51 16.2,18.73 16.2,18.23 19.76,14.67 22.3,14.67 22.55,14.42 27.63,14.42 32.46,9.59 34.24,9.59 34.75,9.08 v34.75,7.81
GPIO1  (via drill 0.8)
  Top 0.203: U3.16 12.32,37.61 11.63,38.29 11.63,39.31 11.12,39.82 v9.6,39.82 | v33.48,8.57 33.48,7.56 35,6.03 37.29,6.03 -X.6
  Bottom 0.203: v9.6,39.82 10.87,39.82 14.68,36.01 15.7,36.01 16.2,35.5 16.2,23.81 17.47,22.54 17.47,20.77 15.44,18.73 15.44,18.23 19.51,14.16 22.05,14.16 22.3,13.91 27.38,13.91 32.21,9.08 32.97,9.08 v33.48,8.57
GPIO2  (via drill 0.8)
  Top 0.203: U3.17 11.04,37.11 v10.11,38.04 | v32.46,7.56 32.71,7.56 35.76,4.51 -X.5
  Bottom 0.203: v10.11,38.04 11.89,38.04 14.43,35.5 15.44,35.5 15.7,35.24 15.7,23.56 16.97,22.29 16.97,21.02 14.68,18.73 14.68,18.23 19.25,13.65 21.79,13.65 22.05,13.4 27.13,13.4 30.17,10.35 30.17,9.84 v32.46,7.56
GPIO3
  Top 0.203: U3.97 16.96,50.47 28.65,62.17 +X.2 28.65,65.72
GPIO4
  Top 0.203: U3.96 17.46,50.21 31.19,63.95 +X.3 31.19,65.72
GPIO5
  Top 0.203: U3.95 17.96,49.95 29.92,61.91 30.17,61.91 +X.4
GPIO6
  Top 0.203: U3.94 18.46,49.69 30.17,61.41 32.21,61.41 +X.5
GPIO7
  Top 0.203: U3.93 18.96,49.43 30.43,60.9 34.24,60.9 +X.6
GPIO8
  Top 0.203: U3.92 19.46,49.16 30.68,60.39 36.27,60.39 +X.7
HP  (via drill 0.6)
  Top 0.254: GYR2.13 33.81,54.72 v32.97,55.56 33.73,56.33 R11.2 | GYR3.13 43.65,55.29 v43.13,55.82
  Bottom 0.254: v43.13,55.82 41.86,54.55 33.98,54.55 v32.97,55.56
MISO  (via drill 0.61, 0.8)
  Top 0.203: U3.22 11.5,34.61 11.12,34.23 11.12,25.59 13.92,22.8 15.19,22.8 15.95,22.04 v15.95,21.78 | v48.61,19.14 55.73,19.14 U2.7
  Bottom 0.203: 15.7,21.53 v15.95,21.78 14.17,20 14.17,17.97 19,13.15 21.54,13.15 21.79,12.89 26.87,12.89 29.67,10.1 29.67,8.57 31.93,6.31 | 31.93,6.31 -X.4 | v48.61,19.14 35.81,6.34 31.95,6.34 31.93,6.31
MOSI  (via drill 0.61, 0.8)
  Top 0.203: U3.21 10.73,35.11 10.62,34.99 10.62,25.08 13.92,21.78 v14.17,21.78 | v39.67,14.06 42.32,14.06 U1.5 | v34.59,11.62 30.94,7.96 30.94,5.32 -X.3
  Bottom 0.203: -X.3 31.19,4.76 29.16,6.8 29.16,9.84 26.62,12.38 21.54,12.38 21.28,12.64 18.74,12.64 13.66,17.72 13.66,21.27 v14.17,21.78 | v39.67,14.06 37.23,11.62 v34.59,11.62
N$1  (via drill 0.6)
  Top 0.254: U3.43 23.96,29.28 23.31,28.63 R3.2 23.32,28.57 v23.32,26.86 | 22.3,17.33 22.3,17.21 | $$U$1.3 22.3,17.33 | v21.28,20.51 22.3,19.5 22.3,17.33
  Bottom 0.254: v23.32,26.86 21.28,24.83 v21.28,20.51
N$2
  Top 0.203: MAG1.9 34.8,32.35 34.19,32.35 34.19,30.93 35,30.11 35,29.1 C4.1
N$3
  Top 0.203: MAG1.14 37.23,30.72 37.23,29.1 C4.2
N$4
  Top 0.203: C10.1 44.55,45.76 43.74,46.57 C9.1
  Top 0.254: GYR3.2 44.4,49.66 44.4,48.71 44.14,48.45 43.64,48.45 43.13,47.94 C9.1
N$5
  Top 0.203: 37.85,31.13 37.85,31.74 36.83,31.74 36.83,31.13 MAG1.13 | 37.85,31.13 MAG1.15 | C6.1 43.89,30.17 43.89,30.16 42.93,31.13 37.85,31.13
N$6
  Bottom 0.203: XB.A 39.88,34.38 38.66,34.38 37.64,33.36 35.41,33.36 33.98,34.79 33.98,36.41 XBEE.6
N$7  (via drill 0.8)
  Top 0.203: U3.98 16.46,54.04 v16.2,54.29 | L1.2 13.46,56.38 13.41,56.33 v13.41,55.06
  Top 0.254: L1.2 13.41,56.4 13.41,56.33 12.38,56.33 C13.1
  Bottom 0.203: v16.2,54.29 14.17,54.29 v13.41,55.06
N$8
  Bottom 0.203: XB.C 40.49,31.33 40.49,30.52 R100.1
N$9  (via drill 0.6)
  Top 0.254: 25.11,28.62 R4.2 | U3.44 24.46,29.28 25.11,28.62 | 25.11,28.62 25.09,28.6 v25.09,26.86 | $$U$1.6 22.3,23.56 22.3,21.78 v23.57,20.51
  Bottom 0.254: v25.09,26.86 23.57,25.34 v23.57,20.51
N$10
  Top 0.203: U2.2 59.38,23.41 60.2,23.41 60.2,23 60.4,22.8 60.4,14.87 57.55,12.03 44.96,12.03 44.96,10.2 44.14,10.2 U1.2
N$11
  Top 0.203: U2.3 59.18,22.19 59.99,22.19 59.99,15.08 57.76,12.84 44.14,12.84 U1.4
N$12
  Top 0.203: U2.5 56.95,21.17 45.16,21.17 45.16,15.48 44.96,15.28 44.14,15.28 U1.6
N$13  (via drill 0.61)
  Top 0.203: U3.33 18.95,31.74 18.95,33.16 19.51,33.72 20.01,33.72 20.78,34.48 20.78,35.5 19.46,36.82 v17.32,36.82
  Bottom 0.203: Q100.3 18.13,36.82 v17.32,36.82 17.12,37.22 17.12,38.65 C100.2
N$14  (via drill 0.6)
  Top 0.254: U3.34 19.46,32.91 19.76,33.21 v20.78,33.21
  Bottom 0.203: C101.2 24.43,38.65 24.43,34.79 23.62,34.79 Q100.1
  Bottom 0.254: 22.81,34.73 22.81,34.74 | 22.81,34.73 Q100.1 | v20.78,33.21 21.28,33.21 22.81,34.73
N$21
  Top 0.254: C5.1 40.08,23.05 38.82,21.79 GYR1.20
N$22
  Top 0.203: C1.1 30.94,22.29 GYR1.10
N$23
  Top 0.254: R8.1 46.94,44.39 46.43,43.88 43.89,43.88 43.13,44.64 43.13,45.15 C9.2
N$24
  Top 0.254: GYR3.3 45.25,47.28 45.16,47.18 C10.2 46.87,47.11 46.94,47.18 R8.2
N$25
  Top 0.254: GYR3.10 46.05,55.19 46.43,55.56 48.72,55.56 R15.2
N$28
  Top 0.254: GYR3.4 46.05,48.83 46.43,48.45 48.21,48.45 48.72,47.94 R9.2
N$29  (via drill 0.61)
  Top 0.203: v14.48,32.14 14.48,31.54 15.29,31.54 U3.26 | v7.37,38.44 7.37,42.3 R5.2
  Bottom 0.203: v14.48,32.14 11.23,35.4 10.41,35.4 v7.37,38.44
N$30
  Top 0.203: ST.A 5.13,44.74 5.13,43.73 R5.1
N$31
  Top 0.203: R10.2 57.01,44.13 57.1,44.13 57.1,46.14 PWR.A
N$42
  Top 0.254: GYR2.10 36.21,55 37.03,55.82 38.81,55.82 R14.2
N$45
  Top 0.203: C8.1 34.39,45.76 33.58,46.57 C7.1
  Top 0.254: GYR2.2 34.61,48.83 34.24,48.45 33.73,48.45 32.97,47.69 32.97,46.86 | 32.97,46.86 32.97,46.67 | C7.1 32.97,46.86
N$46
  Top 0.254: C7.2 32.97,44.9 33.73,44.13 36.02,44.13 36.78,44.9 R7.1
N$47
  Top 0.254: GYR2.3 35.41,47.6 35,47.18 C8.2 35.32,47.44 36.78,47.44 R7.2
PD  (via drill 0.6)
  Top 0.254: GYR2.12 34.61,55.44 v34.49,55.56 35.25,56.33 R12.2 | GYR3.12 44.45,55.76 v44.4,55.82
  Bottom 0.254: v44.4,55.82 43.38,56.83 35.76,56.83 v34.49,55.56
RST
  Top 0.203: R6.1 7.77,49.82 7.97,49.82 7.97,51.25 8.18,51.25 C12.1
  Top 0.254: R6.1 6.3,49.21 3.76,46.67 3.76,39.31 5.54,37.53 6.3,37.53 7.57,36.26 7.57,33.72 6.04,32.2 6.04,26.1 5.1,25.16 | 5.1,25.16 5.03,25.08 | -Y.7 5.1,25.16
RXD0
  Top 0.203: 8.58,43.63 8.58,42.61 8.08,42.1 8.08,39.05 8.58,38.55 8.58,25.08
  Top 0.254: U3.2 9.57,44.61 8.58,43.63 | -Y.6 6.46,22.96 8.58,25.08
SCK  (via drill 0.61, 0.8)
  Top 0.203: U3.20 10.47,35.61 10.11,35.24 10.11,24.07 v12.39,21.78 | v39.67,16.5 42.32,16.5 U1.7 | v34.8,13.45 28.9,7.56 28.9,5.32 -X.2
  Bottom 0.203: v12.39,21.78 12.9,21.27 12.9,20.26 13.16,20 13.16,17.46 18.49,12.13 21.03,12.13 21.28,11.88 26.36,11.88 28.65,9.59 -X.2 | v39.67,16.5 36.63,13.45 v34.8,13.45
SCL  (via drill 0.61, 0.8)
  Top 0.203: R2.2 21.28,15.43 21.28,16.45 $$U$1.2 | v47.8,42.71 47.8,42.36 | MAG1.1 37.85,34.99 38.05,34.99 v38.05,35.8 35.2,35.8 33.17,33.77 33.17,31.94 31.42,30.19 24.84,23.61 24.84,14.16 24.59,13.91 22.05,13.91 21.28,14.67 R2.2 | R2.2 22,15.08
  Top 0.254: 52.27,41.34 ACC2.14 51,42.36 47.8,42.36 44.4,42.36 43.89,41.85 ACC1.14 | -Y.3 13.5,16.36 16.46,13.4 21.03,13.4 21.28,13.65 21.28,14.42 21.54,14.67 R2.2 | GYR1.23 36.5,23.31 v37.79,23.31 | 31.42,30.19 31.44,30.16 v31.19,29.91
  Bottom 0.203: 14.17,49.72 TMP100.1 14.27,49.62 14.27,47.99 15.7,47.99 16.31,47.38 16.31,46.17 | 16.31,46.17 17.32,46.17 BAR100.6 | v47.8,42.71 44.96,42.71 v38.05,35.8 37.64,36.01 36.83,36.01 35.2,37.63 31.75,37.63 31.75,37.22 25.65,37.22 25.65,40.27 23.32,42.61 19.25,42.61 17.98,43.88 17.22,43.88 16.31,44.79 16.31,46.17
  Bottom 0.254: v37.79,23.31 38.05,23.56 38.05,24.58 35.51,27.12 33.73,27.12 31.19,29.66 v31.19,29.91
SDA  (via drill 0.61, 0.8)
  Top 0.203: 40.49,35.19 v40.49,36.21 40.89,36.01 42.72,36.01 45.57,33.16 45.57,28.69 40.69,28.69 38.96,26.96 36.83,24.83 36.83,23.81 GYR1.24 | 40.49,35.19 40.49,33.97 38.86,33.97 MAG1.20 | v30.94,45.76 31.34,45.35 31.34,44.34 40.49,35.19 | 18.34,19.34 18.74,18.94 v18.74,18.73 | v32.36,25.44 32.77,25.85
  Top 0.254: ACC1.13 46.88,41.4 v46.94,41.34 | ACC2.13 52.1,41.42 52.02,41.34 v53.8,41.34 | -Y.4 15.36,18.56 17.22,16.7 R1.2 17.22,18.23 18.34,19.34 21.03,22.04 21.03,23.56 $$U$1.7 | 32.77,25.85 33.78,26.86 | 33.78,26.86 33.73,26.86 | 38.96,26.96 38.86,26.86 33.78,26.86
  Bottom 0.203: 17.53,48.6 15.29,50.84 14.27,50.84 TMP100.6 | 17.53,48.6 17.53,47.59 BAR100.7 | v40.49,36.21 45.57,41.29 46.38,41.29 v46.94,41.34 | 17.53,48.6 18.74,49.82 22.81,49.82 26.87,45.76 v30.94,45.76 | v18.74,18.73 19.56,17.92 26.26,17.92 32.36,24.02 v32.36,25.44
  Bottom 0.254: v46.94,41.34 v53.8,41.34
ST
  Top 0.254: GYR2.11 35.41,55.22 36.78,56.58 | GYR3.11 45.25,56.49 44.91,56.83 42.11,56.83 41.35,57.6 39.83,57.6 39.06,56.83 37.03,56.83 36.78,56.58 | 36.78,56.58 R13.2
TXD0
  Top 0.203: 9.09,43.37 9.09,42.36 8.58,41.85 8.58,39.31 9.09,38.8 9.09,22.04
  Top 0.254: U3.3 9.83,44.11 9.09,43.37 | -Y.5 7.82,20.76 9.09,22.04
XBEE-RX  (via drill 0.6)
  Top 0.254: U3.46 25.46,40.69 v27.13,42.36
  Bottom 0.254: XBEE.3 36.1,43.12 27.38,43.12 27.13,42.86 v27.13,42.36
XBEE-TX  (via drill 0.6)
  Top 0.254: v26.11,43.37 26.11,42.36 24.84,41.09 24.84,32.7 24.96,32.59 U3.45
  Bottom 0.254: XBEE.2 32.41,43.63 26.36,43.63 v26.11,43.37
XOUT-1X  (via drill 0.6)
  Top 0.203: U3.86 22.46,49.62 v28.14,55.31 | GYR3.9 46.93,54.04 50.75,54.04 | v52.27,54.04 50.75,54.04 | C16.1 50.56,54.04 50.75,54.04
  Top 0.254: C16.1 50.49,54.04 50.36,53.9 R15.1
  Bottom 0.203: v52.27,54.04 52.27,54.8 51.76,55.31 46.43,55.31 44.4,57.34 31.95,57.34 29.67,55.31 v28.14,55.31
XOUT-4X  (via drill 0.6)
  Top 0.203: U3.87 21.96,49.89 26.87,54.8 26.87,55.82 27.89,56.83 v28.4,56.83 | GYR3.8 47.51,52.77 v52.02,52.77
  Bottom 0.203: v52.02,52.77 52.27,52.77 53.29,53.79 53.29,54.55 52.02,55.82 46.68,55.82 44.65,57.85 31.7,57.85 30.43,56.83 v28.4,56.83
YOUT-1X  (via drill 0.6)
  Top 0.203: U3.84 23.46,49.1 28.14,53.79 28.65,53.79 29.92,55.06 29.92,56.58 31.19,57.85 31.19,58.87 v31.7,59.37 | C11.1 50.56,49.98 v52.27,49.98
  Top 0.254: C11.1 48.78,49.91 48.72,49.98 R9.1 47.08,49.86 46.93,49.71 GYR3.5
  Bottom 0.203: v52.27,49.98 54.3,52.01 54.3,55.06 52.53,56.83 47.19,56.83 45.16,58.87 33.48,58.87 32.97,59.37 v31.7,59.37
YOUT-4X  (via drill 0.6)
  Top 0.203: U3.85 22.96,49.36 27.89,54.29 28.4,54.29 29.41,55.31 29.41,57.6 v30.17,58.36 | GYR3.6 47.59,51.25 v52.02,51.25
  Bottom 0.203: v52.02,51.25 53.8,53.02 53.8,54.8 52.27,56.33 46.94,56.33 44.91,58.36 v30.17,58.36
ZOUT-1X  (via drill 0.6)
  Top 0.203: U3.82 24.46,48.58 24.84,48.96 v25.6,48.96 | C15.1 40.4,53.85 40.33,53.79 40.59,53.53
  Top 0.254: GYR2.9 38.55,54.05 38.81,53.79 | 38.81,53.79 38.88,53.85 C15.1 40.59,53.79 39.83,53.02 39.83,51.75 40.59,50.99 v40.59,50.23 | 38.81,53.79 R14.1
  Bottom 0.203: v25.6,48.96 39.32,48.96 v40.59,50.23
ZOUT-4X  (via drill 0.6)
  Top 0.203: U3.83 23.96,48.84 25.09,49.98 v27.38,49.98 | v39.32,50.99 39.32,52.01 38.81,52.52 37.79,52.52 37.66,52.65 GYR2.8
  Bottom 0.203: v27.38,49.98 38.3,49.98 v39.32,50.99

### Text on the board
Bottom: Re-entry Experiment | CDH r1.0 | Board by: Casey Kuhns | Open "ReadMe.txt" on SD | Reward for return | Northern Colorado | University of